# Altium schematic sheet ProportionalDrive.SchDoc
size A4
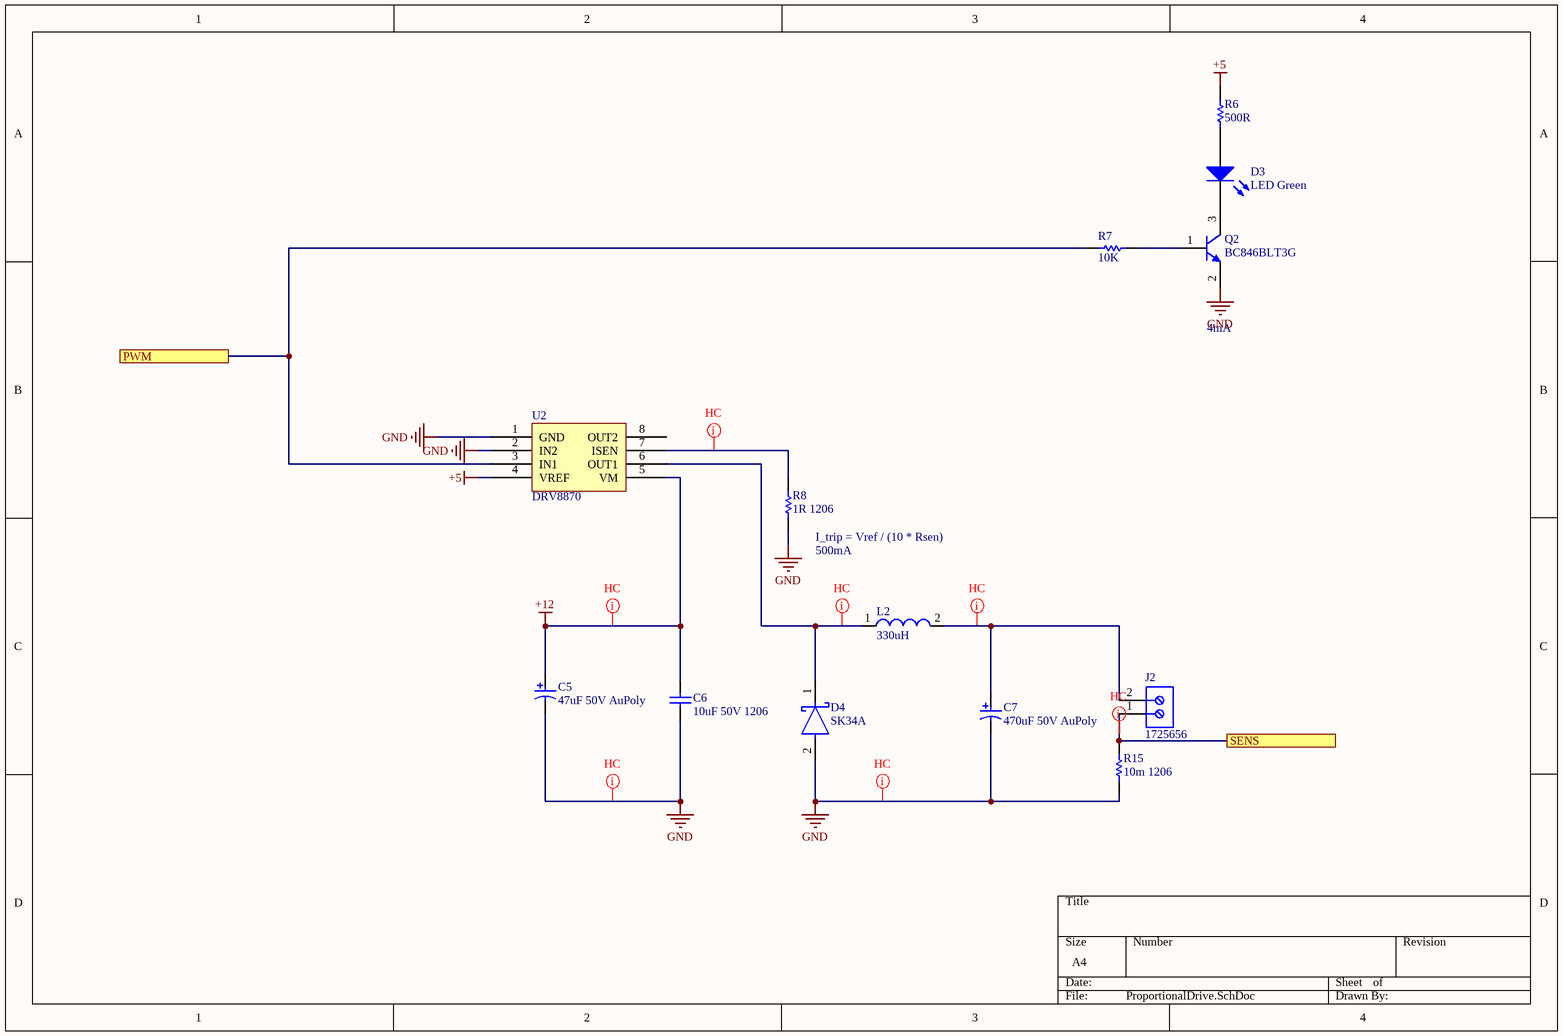
[diagram p0: ProportionalDrive.SchDoc]

## Parts
C5  47uF 50V AuPoly  [EEH-ZA1H220P]
C6  10uF 50V 1206  [CAPC1206(3216)190_N]
C7  470uF 50V AuPoly  [CAPAE137130X163M]
D3  LED Green  [0603_A]
D4  SK34A  [FP-DO-214AC-MFG]
J2  1725656  [PHOE-1725656-2]
L2  330uH  [L1212]
Q2  BC846BLT3G  [ONSC-SOT-23-3-318-08_V]
R6  500R  [RESC0603(1608)_L]
R7  10K  [RESC0603(1608)_N]
R8  1R 1206  [RESC1206(3216)_N]
R15  10m 1206  [RESC1206(3216)_N]
U2  DRV8870  [SOIC127P600X170_HS-9N]

## Ports
PWM, SENS

## Nets
+5: R6.2 U2.4(VREF)
+12: C5.1 C6.2 U2.5(VM)
GND: C5.2 C6.1 C7.2 D4.2(A) Q2.2(E) R8.1 R15.1 U2.1(GND) U2.2(IN2)
PWM: R7.1 U2.3(IN1) ; port PWM
SENS: J2.1 R15.2 ; port SENS
NetC7_1: C7.1 J2.2 L2.2
NetD3_1: D3.1(K) Q2.3(C)
NetD3_2: D3.2(A) R6.1
NetD4_1: D4.1(C) L2.1 U2.6(OUT1)
NetQ2_1: Q2.1(B) R7.2
NetR8_2: R8.2 U2.7(ISEN)

Not connected (* = marked no-connect by the designer): U2 8(OUT2)

## Layout directives
net class HC: +12, GND, NetC7_1, NetD4_1, NetR8_2, SENS

## Notes on the sheet
- 4mA
- (near R8) I_trip = Vref / (10 * Rsen)
- (near R8) 500mA

## Library data of the parts
C5 C7 = C-Poly: Manufacturer: AVX; DELETED: Compliant; Product Depth (mm): 4.3mm; Product Length (mm): 7.3mm; Case Style: Molded; Product Diameter (mm): NotRequiredmm; DF: 6%; Seal: NotRequired; Capacitance: 22000000pF; Product Height (mm): 2.9mm; Rad Hardened: No; ESR: 0.2ohm; Polarity: Polar; DCL: 5.5uA; Voltage: 25VDC; Tolerance (+ or -): 10%; Construction: SMTChip; Mounting Style: SurfaceMount; Packaging: TapeandReel; Case Code: D; Package Reference: 7343-31; Manufacturer URL: http://www.avx.com/; Failure Rate: NotRequired; Insulation: NotRequired; Operating Temp Range: -55Cto125C; Mounting Technology: SurfaceMount; Package Description: 2-Pin Surface Mount Device, Body 7.3 x 4.35 mm; Length W/Weld (max): NotRequiredmm; Lead Spacing (nom): NotRequiredmm; Seated Plane Height: NotRequiredmm; Wire Form: NotRequired; Datasheet Version: 02/2004; Datasheet URL: https://datasheet.ciiva.com/11793/0900766b80066cb4-11793194.pdf; Length W/Weld: NotRequiredmm; Package / Case: 7343-31
C6 = CMP-1037-04983-1: CAP 10uF 50V ±20% 1206 (3216 Metric) Thickness 1.9mm SMD; Tolerance: Â±20%; Case-Metric: 3216; Case-EIA: 1206; Technology: SMT; Max Thickness: 1.9 mm; Rated Voltage: 50 V; Value: 10uF
D3 = CMP-1426-00002-1: SMD mono-color Chip LED, WL-SMCW, Green; PartNumber: 150060GS75000; Manufacturer: Wuerth Elektronik; ComponentLink1URL: http://www.we-online.com; ComponentLink2Description: Datasheet; Color: Green; ComponentLink2URL: http://katalog.we-online.com/led/datasheet/150060GS75000.pdf; PackageReference: 0603_A; ComponentLink1Description: Manufacturer URL
D4 = CMP-56206-000004-1: DIODE SCHOTTKY 5A 30V SMA; Mount: Surface Mount; Max Reverse Voltage (DC): 30V; Case/Package: SMA; Packaging: Tape and Reel; Average Rectified Current: 5A
J2 = CMP-2000-05299-1: Male Header, Pitch 2.54 mm, 1 x 2 Position, Height 9 mm, Tail Length 3.5 mm; Manufacturer: Phoenix Contact; Number of contacts: 2; Content: 250pc(s); Pitch: 2.54mm; Industrial packaging: Yes; Colour: Green; Manufacturer part No.: 1725656; Type: MPT0,5/2-2,54; Datasheet URL: http://datasheet.octopart.com/1725656-Phoenix-Contact-datasheet-5302866.pdf; Manufacturer URL: http://www.phoenixcontact.com/; Datasheet Version: Apr-08
L2 = Inductor1212: Manufacturer: Wuerth Elektronik; PartNumber: 74479763215; Inductance: 1.50 ÂµH; ComponentLink1Description: Manufacturer URL; PackageReference: SMD 0603_A; ComponentLink1URL: http://www.we-online.com; ComponentLink2URL: http://katalog.we-online.de/kataloge/eisos/media/pdf/74479763215.pdf; ComponentLink2Description: Datasheet
Q2 = CMP-1048-00780-1: General Purpose Transistor, NPN Silicon, 3-Pin SOT-23, Pb-Free, Tape and Reel; Manufacturer: On Semiconductor; fT Min (MHz): 100; IC Continuous (A): 0.1; ComponentLink2Description: Datasheet; Packing: Tape and Reel; Mounting Technology: Surface Mount; Polarity: NPN; PackageDescription: 3-Pin Small Outline Transistor, Body 2.92 x 1.3 mm, Pitch 0.95 mm; ComponentLink1Description: Manufacturer URL; PackageVersion: Rev. AP, 11/2009; ComponentLink3Description: Package Specification; ComponentLink3URL: http://www.onsemi.cn/pub_link/Collateral/318-08.PDF; PartNumber: BC846BLT3G; RoHS: TRUE; ComponentLink2URL: http://www.onsemi.cn/pub_link/Collateral/BC846ALT1-D.PDF; PackageReference: SOT-23-3-318-08; DatasheetVersion: Rev. 11; ComponentLink1URL: http://www.onsemi.com/
R6 = CMP-1012-00067-1: 510R 0.1W 5% 0603 (1608 Metric)  SMD; Case-EIA: 0603; Value: 510.00 Ohm; Case-Metric: 1608; Technology: SMT; Power: 0.1 W; Tolerance: 5 %
R7 = CMP-1012-00623-1: 10K 0.1W 1% 0603 (1608 Metric)  SMD; Value: 10000.00 Ohm; Case-EIA: 0603; Case-Metric: 1608; Power: 0.1 W; Tolerance: 1 %; Technology: SMT
R8 R15 = CMP-1014-00004-1: 1R2 0.25W 5% 1206 (3216 Metric)  SMD; Value: 1.20 Ohm; Case-Metric: 3216; Case-EIA: 1206; Power: 0.25 W; Technology: SMT; Tolerance: 5 %